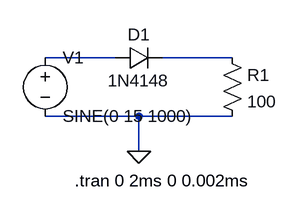
[diagram p0: schematic Clipper1.asc]
Clipper1.asc, the LTspice schematic file:
Version 4
SHEET 1 880 680
WIRE 144 112 48 112
WIRE 304 112 208 112
WIRE 176 192 48 192
WIRE 304 192 176 192
WIRE 176 240 176 192
FLAG 176 240 0
SYMBOL diode 144 128 R270
WINDOW 0 32 32 VTop 2
WINDOW 3 0 32 VBottom 2
SYMATTR InstName D1
SYMATTR Value 1N4148
SYMBOL voltage 48 96 R0
WINDOW 123 0 0 Left 0
WINDOW 39 0 0 Left 0
SYMATTR InstName V1
SYMATTR Value SINE(0 15 1000)
SYMBOL res 288 96 R0
SYMATTR InstName R1
SYMATTR Value 100
TEXT 88 280 Left 2 !.tran 0 2ms 0 0.002ms

The netlist it stands for:
* Clipper1.asc
D1 N001 N002 1N4148
V1 N001 0 SINE(0 15 1000)
R1 N002 0 100
.model D D
.lib standard.dio
.tran 0 2ms 0 0.002ms
.backanno
.end